# Altium schematic sheet GPS.SchDoc
size A4
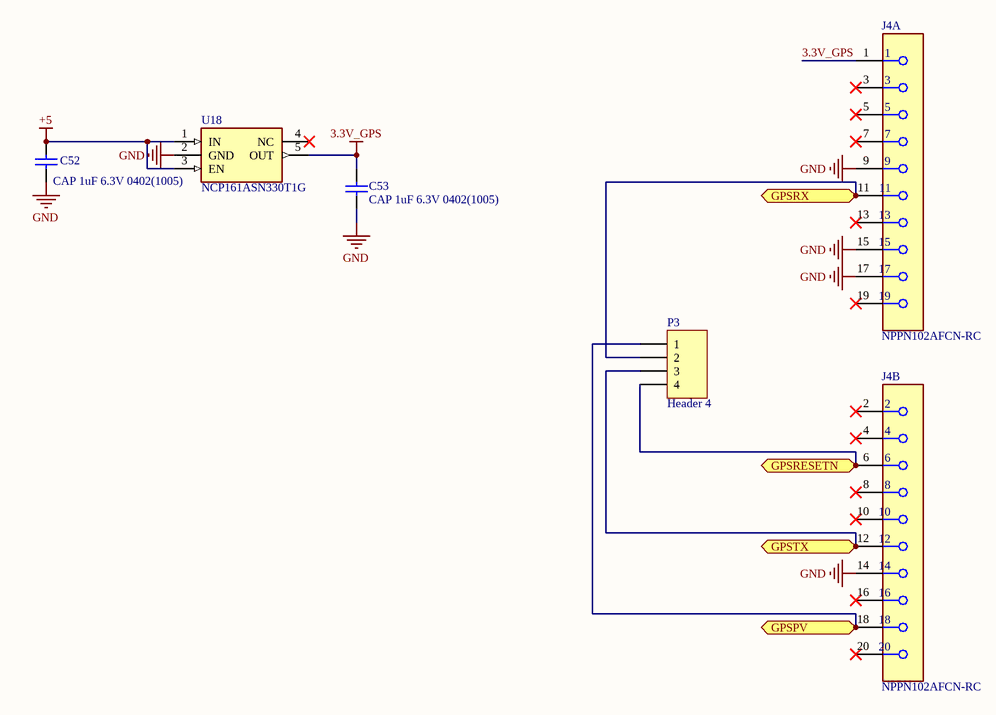
[diagram p0: GPS.SchDoc]

## Parts
C52  CAP 1uF 6.3V 0402(1005)  [CAPC0402(1005)60_L]
C53  CAP 1uF 6.3V 0402(1005)  [CAPC0402(1005)60_L]
J4  NPPN102AFCN-RC  [FP-NPPN102AFCN-RC-MFG]  (parts A,B of 2)
P3  Header 4  [HDR1X4]
U18  NCP161ASN330T1G  [SOT95P280X145-5N]

## Ports
GPSPV (bidir), GPSRESETN (bidir), GPSRX (bidir), GPSTX (bidir)

## Nets
3.3V_GPS: C53.2 J4.1 U18.5(OUT)
+5: C52.2 U18.1(IN) U18.3(EN)
GND: C52.1 C53.1 J4.9 J4.14 J4.15 J4.17 U18.2(GND)
GPSPV: J4.18 P3.1 ; port GPSPV
GPSRESETN: J4.6 P3.4 ; port GPSRESETN
GPSRX: J4.11 P3.2 ; port GPSRX
GPSTX: J4.12 P3.3 ; port GPSTX

Not connected (* = marked no-connect by the designer): J4 2* 3* 4* 5* 7* 8* 10* 13* 16* 19* 20*; U18 4(NC)*

## Library data of the parts
C52 C53 = CMP-1034-02113-1: CAP 1uF 6.3V ±10% 0402 (1005 Metric) Thickness 0.6mm SMD; Case-Metric: 1005; Case-EIA: 0402; Tolerance: Â±10%; Value: 1uF; Technology: SMT; Rated Voltage: 6.3 V; Max Thickness: 0.6 mm
J4 = CMP-25680-000029-1: CONN HDR 20POS 0.079 GOLD PCB; Connector Type: Header; Row Spacing: 0.079inch; Number of Positions: 20; Termination: Solder; Contact Plating: Gold; Number of Rows: 2; Packaging: Bulk; Pitch: 0.079inch; Lead Free: Lead Free; Mount: Through Hole; Package Quantity: 1000; Color: Black
P3 = Header 4: Header, 4-Pin; LatestRevisionDate: 17-Jul-2002; LatestRevisionNote: Re-released for DXP Platform.; Publisher: Altium Limited
U18 = NCP161ASN330T1G: Power Supply; Manufacturer_Name: ON Semiconductor; Datasheet Link: https://componentsearchengine.com/Datasheets/2/NCP161ASN330T1G.pdf; Height: 1.45mm; Manufacturer_Part_Number: NCP161ASN330T1G; Mouser Part Number: 863-NCP161ASN330T1G; Mouser Price/Stock: https://www.mouser.co.uk/ProductDetail/onsemi/NCP161ASN330T1G?qs=vLWxofP3U2ze5zA%252BHmAd3w%3D%3D; Arrow Part Number: NCP161ASN330T1G; Arrow Price/Stock: https://www.arrow.com/en/products/ncp161asn330t1g/on-semiconductor